# EAGLE schematic SynkinoLC_RevA (EAGLE 9.6.2)
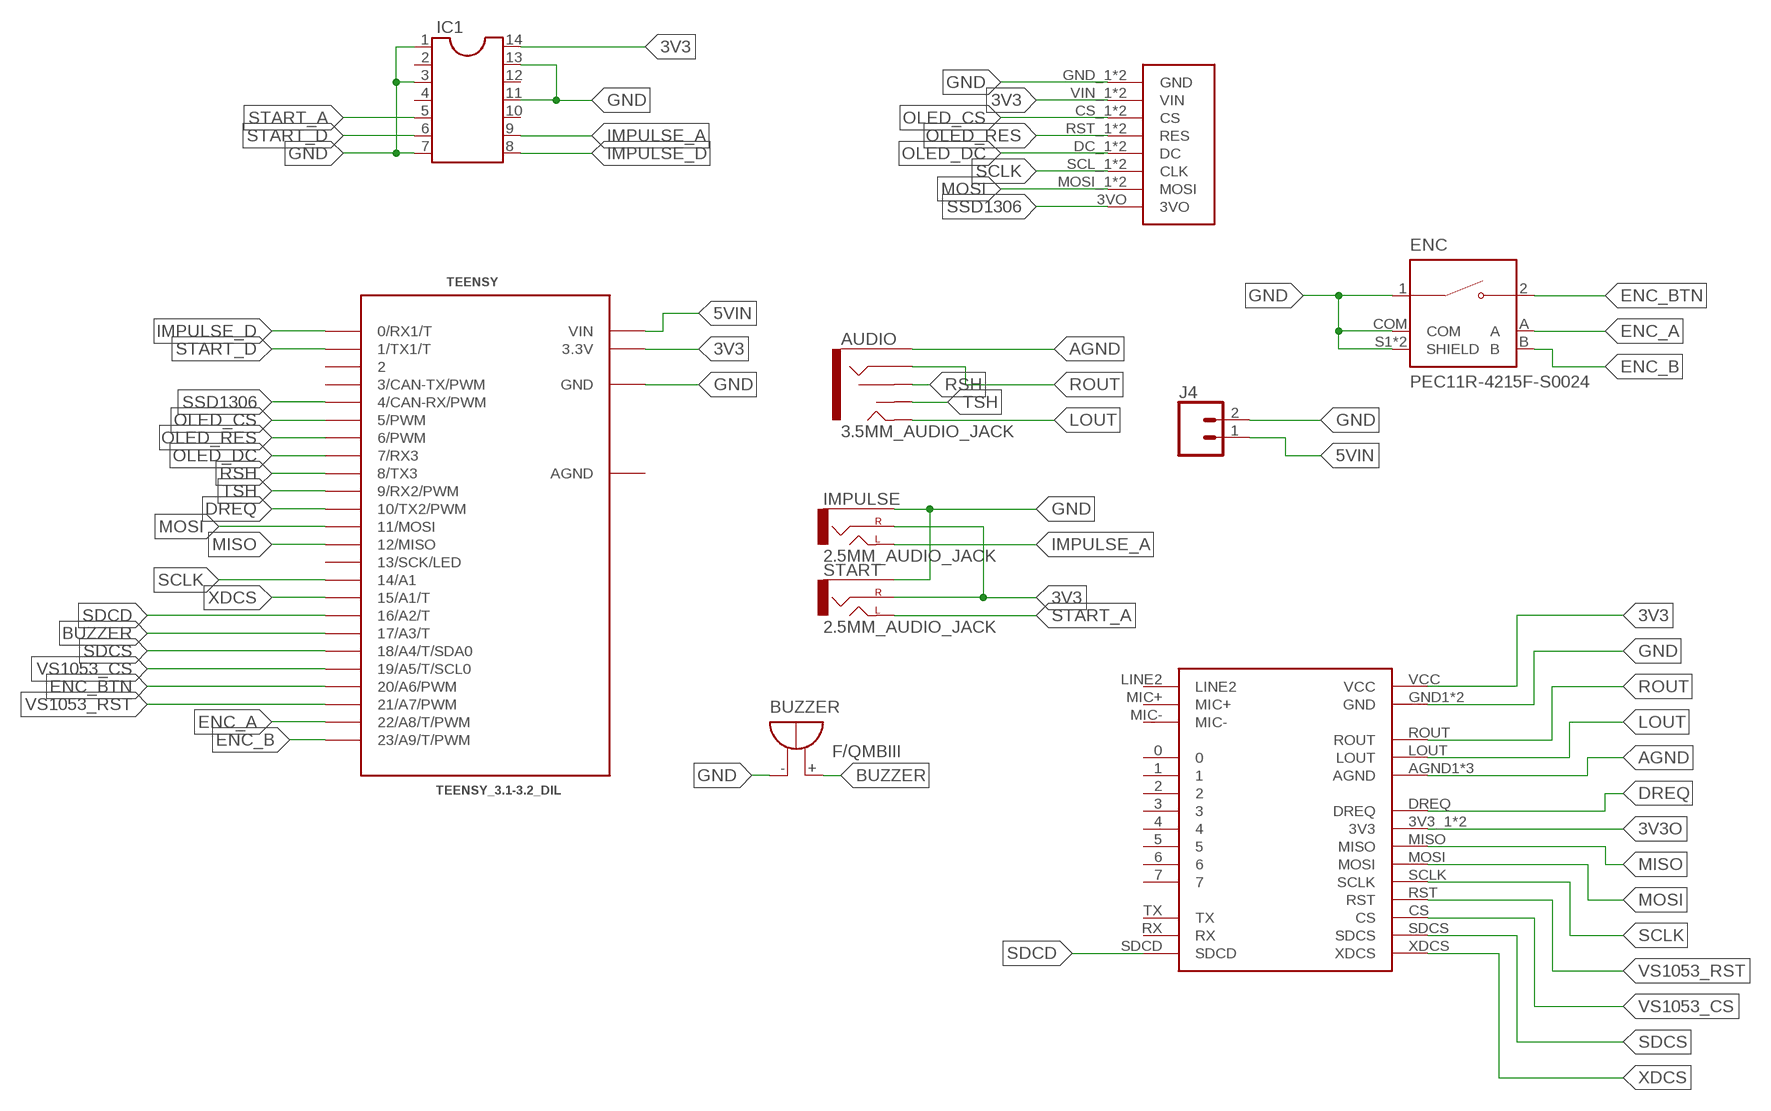
[diagram p0: schematic, sheet 1]

## Parts
AUDIO  3.5MM_AUDIO_JACK  [3.5MM_AUDIO_JACK]
BUZZER  F/QMBIII  [F/QMBIII]
DISPLAY  SPI_DISPLAY  [SPI_DISPLAY]
ENC  PEC11R-4215F-S0024  [XDCR_PEC11R-4215F-S0024]
IC1  DIL14  [DIL14]
IMPULSE  2.5MM_AUDIO_JACK  [2.5MM_AUDIO_JACK]
J4  CONN_021X02_NO_SILK  [1X02_NO_SILK]
START  2.5MM_AUDIO_JACK  [2.5MM_AUDIO_JACK]
TEENSY  TEENSY_3.1-3.2_DIL  [TEENSY_3.0-3.2&LC_DIL]
U$2  VS1053B  [VS1053B]

## Nets
3V3: DISPLAY.VIN_1(VIN) DISPLAY.VIN_2(VIN) IC1.14 IMPULSE.RING(RIGHT) START.RING(RIGHT) TEENSY.3.3V U$2.VCC
3V3O: U$2.3V3_1(3V3) U$2.3V3_2(3V3)
5VIN: J4.1 TEENSY.VIN
AGND: AUDIO.SLEEVE U$2.AGND1(AGND) U$2.AGND2(AGND) U$2.AGND3(AGND)
BUZZER: BUZZER.+(-) TEENSY.17/A3(17/A3/T)
DREQ: TEENSY.10(10/TX2/PWM) U$2.DREQ
ENC_A: ENC.A TEENSY.22/A8(22/A8/T/PWM)
ENC_B: ENC.B TEENSY.23/A9(23/A9/T/PWM)
ENC_BTN: ENC.2 TEENSY.20/A6(20/A6/PWM)
GND: BUZZER.-(+) DISPLAY.GND_1(GND) DISPLAY.GND_2(GND) ENC.1 ENC.COM ENC.S1(SHIELD) ENC.S2(SHIELD) IC1.1 IC1.3 IC1.7 IC1.11 IC1.13 IMPULSE.SLEEVE J4.2 START.SLEEVE TEENSY.GND U$2.GND1(GND) U$2.GND2(GND)
IMPULSE_A: IC1.9 IMPULSE.TIP_1(LEFT) IMPULSE.TIP_2(LEFT)
IMPULSE_D: IC1.8 TEENSY.0(0/RX1/T)
LOUT: AUDIO.TIP U$2.LOUT
MISO: TEENSY.12(12/MISO) U$2.MISO
MOSI: DISPLAY.MOSI_1(MOSI) DISPLAY.MOSI_2(MOSI) TEENSY.11(11/MOSI) U$2.MOSI
OLED_CS: DISPLAY.CS_1(CS) DISPLAY.CS_2(CS) TEENSY.5(5/PWM)
OLED_DC: DISPLAY.DC_1(DC) DISPLAY.DC_2(DC) TEENSY.7(7/RX3)
OLED_RES: DISPLAY.RST_1(RES) DISPLAY.RST_2(RES) TEENSY.6(6/PWM)
ROUT: AUDIO.RING U$2.ROUT
RSH: AUDIO.RSH TEENSY.8(8/TX3)
SCLK: DISPLAY.SCL_1(CLK) DISPLAY.SCL_2(CLK) TEENSY.14/A0(14/A1) U$2.SCLK
SDCD: TEENSY.16/A2(16/A2/T) U$2.SDCD
SDCS: TEENSY.18/A4(18/A4/T/SDA0) U$2.SDCS
SSD1306: DISPLAY.3VO TEENSY.4(4/CAN-RX/PWM)
START_A: IC1.5 START.TIP_1(LEFT) START.TIP_2(LEFT)
START_D: IC1.6 TEENSY.1(1/TX1/T)
TSH: AUDIO.TSH TEENSY.9(9/RX2/PWM)
VS1053_CS: TEENSY.19/A5(19/A5/T/SCL0) U$2.CS
VS1053_RST: TEENSY.21/A7(21/A7/PWM) U$2.RST
XDCS: TEENSY.15/A1(15/A1/T) U$2.XDCS
Unconnected: IC1.2 IC1.4 IC1.10 IC1.12 TEENSY.2 TEENSY.3(3/CAN-TX/PWM) TEENSY.13(13/SCK/LED) U$2.0 U$2.1 U$2.2 U$2.3 U$2.4 U$2.5 U$2.6 U$2.7 U$2.LINE2 U$2.MIC+ U$2.MIC- U$2.RX U$2.TX

## Power pins joined to a net without a drawn wire
AGND: TEENSY.AGND

## Library data of the parts
AUDIO = synkino:3.5MM_AUDIO_JACK
BUZZER = buzzer:F/QMBIII: BUZZER Source: Buerklin; OC_FARNELL: unknown; OC_NEWARK: unknown
DISPLAY = synkino:SPI_DISPLAY
ENC = PEC11R-4215F-S0024:PEC11R-4215F-S0024: Incremental Encoder, 12 Mm, Contact Rating 10 Ma - 5 Vdc Check availability <https://pricing.snapeda.com/parts/PEC11R-4215F-S0024/Bourns/view-part?ref=eda>; AVAILABILITY: In Stock; DESCRIPTION: Rotary Encoder Mechanical 24 Quadrature (Incremental) Vertical; MF: Bourns; MP: PEC11R-4215F-S0024; PACKAGE: None; PRICE: None; PURCHASE-URL: https://pricing.snapeda.com/search/part/PEC11R-4215F-S0024/?ref=eda
IC1 = ic-package:DIL14: Dual In Line / Socket
IMPULSE START = synkino:2.5MM_AUDIO_JACK
J4 = SparkFun-Connectors:CONN_02: Multi connection point. Often used as Generic Header-pin footprint for 0.1 inch spaced/style header connections On any of the 0.1 inch spaced packages, you can populate with these: Break Away Headers - Straight <https://www.sparkfun.com/products/116> (PRT-00116) Break Away Male Headers - Right Angle <https://www.sparkfun.com/products/553> (PRT-00553) Female Headers <https://www.sparkfun.com/products/115> (PRT-00115) Break Away Headers - Machine Pin <https://www.sparkfun.com/products/117> (PRT-00117) Break Away Female Headers - Swiss Machine Pin <https://www.sparkfun.com/products/743> (PRT-00743) For SCREWTERMINALS and SPRING TERMINALS visit here: Screw Terimnals on SparkFun.com <https://www.sparkfun.com/search/results?term=Screw+Terminals> (5mm/3.5mm/2.54mm spacing) This device is also useful as a general connection point to wire up your design to another part of your project. Our various solder wires solder well into these plated through hole pads. Hook-Up Wire - Assortment (Stranded, 22 AWG) <https://www.sparkfun.com/products/11375> (PRT-11375) Hook-Up Wire - Assortment (Solid Core, 22 AWG) <https://www.sparkfun.com/products/11367> (PRT-11367) View the entire wire category on our website here <https://www.sparkfun.com/categories/141> Special notes: Molex polarized connector foot print use with: PRT-08233 with associated crimp pins and housings. 2.54_SCREWTERM for use with PRT-10571. 3.5mm Screw Terminal footprints for PRT-08084 5mm Screw Terminal footprints for use with PRT-08432
TEENSY = Teensy_3_and_LC_Series_Boards_v1.4:TEENSY_3.1-3.2_DIL: Teensy 3.1 or 3.2 in a DIL Layout.
U$2 = VS1053B:VS1053B